# EasyEDA schematic Schematic_drone.json
TITLE: DRONE PCB; REV: 1.0; Date: 2023-12-03; Sheet: 1/1; Drawn By: s3713061; Company: Your Company
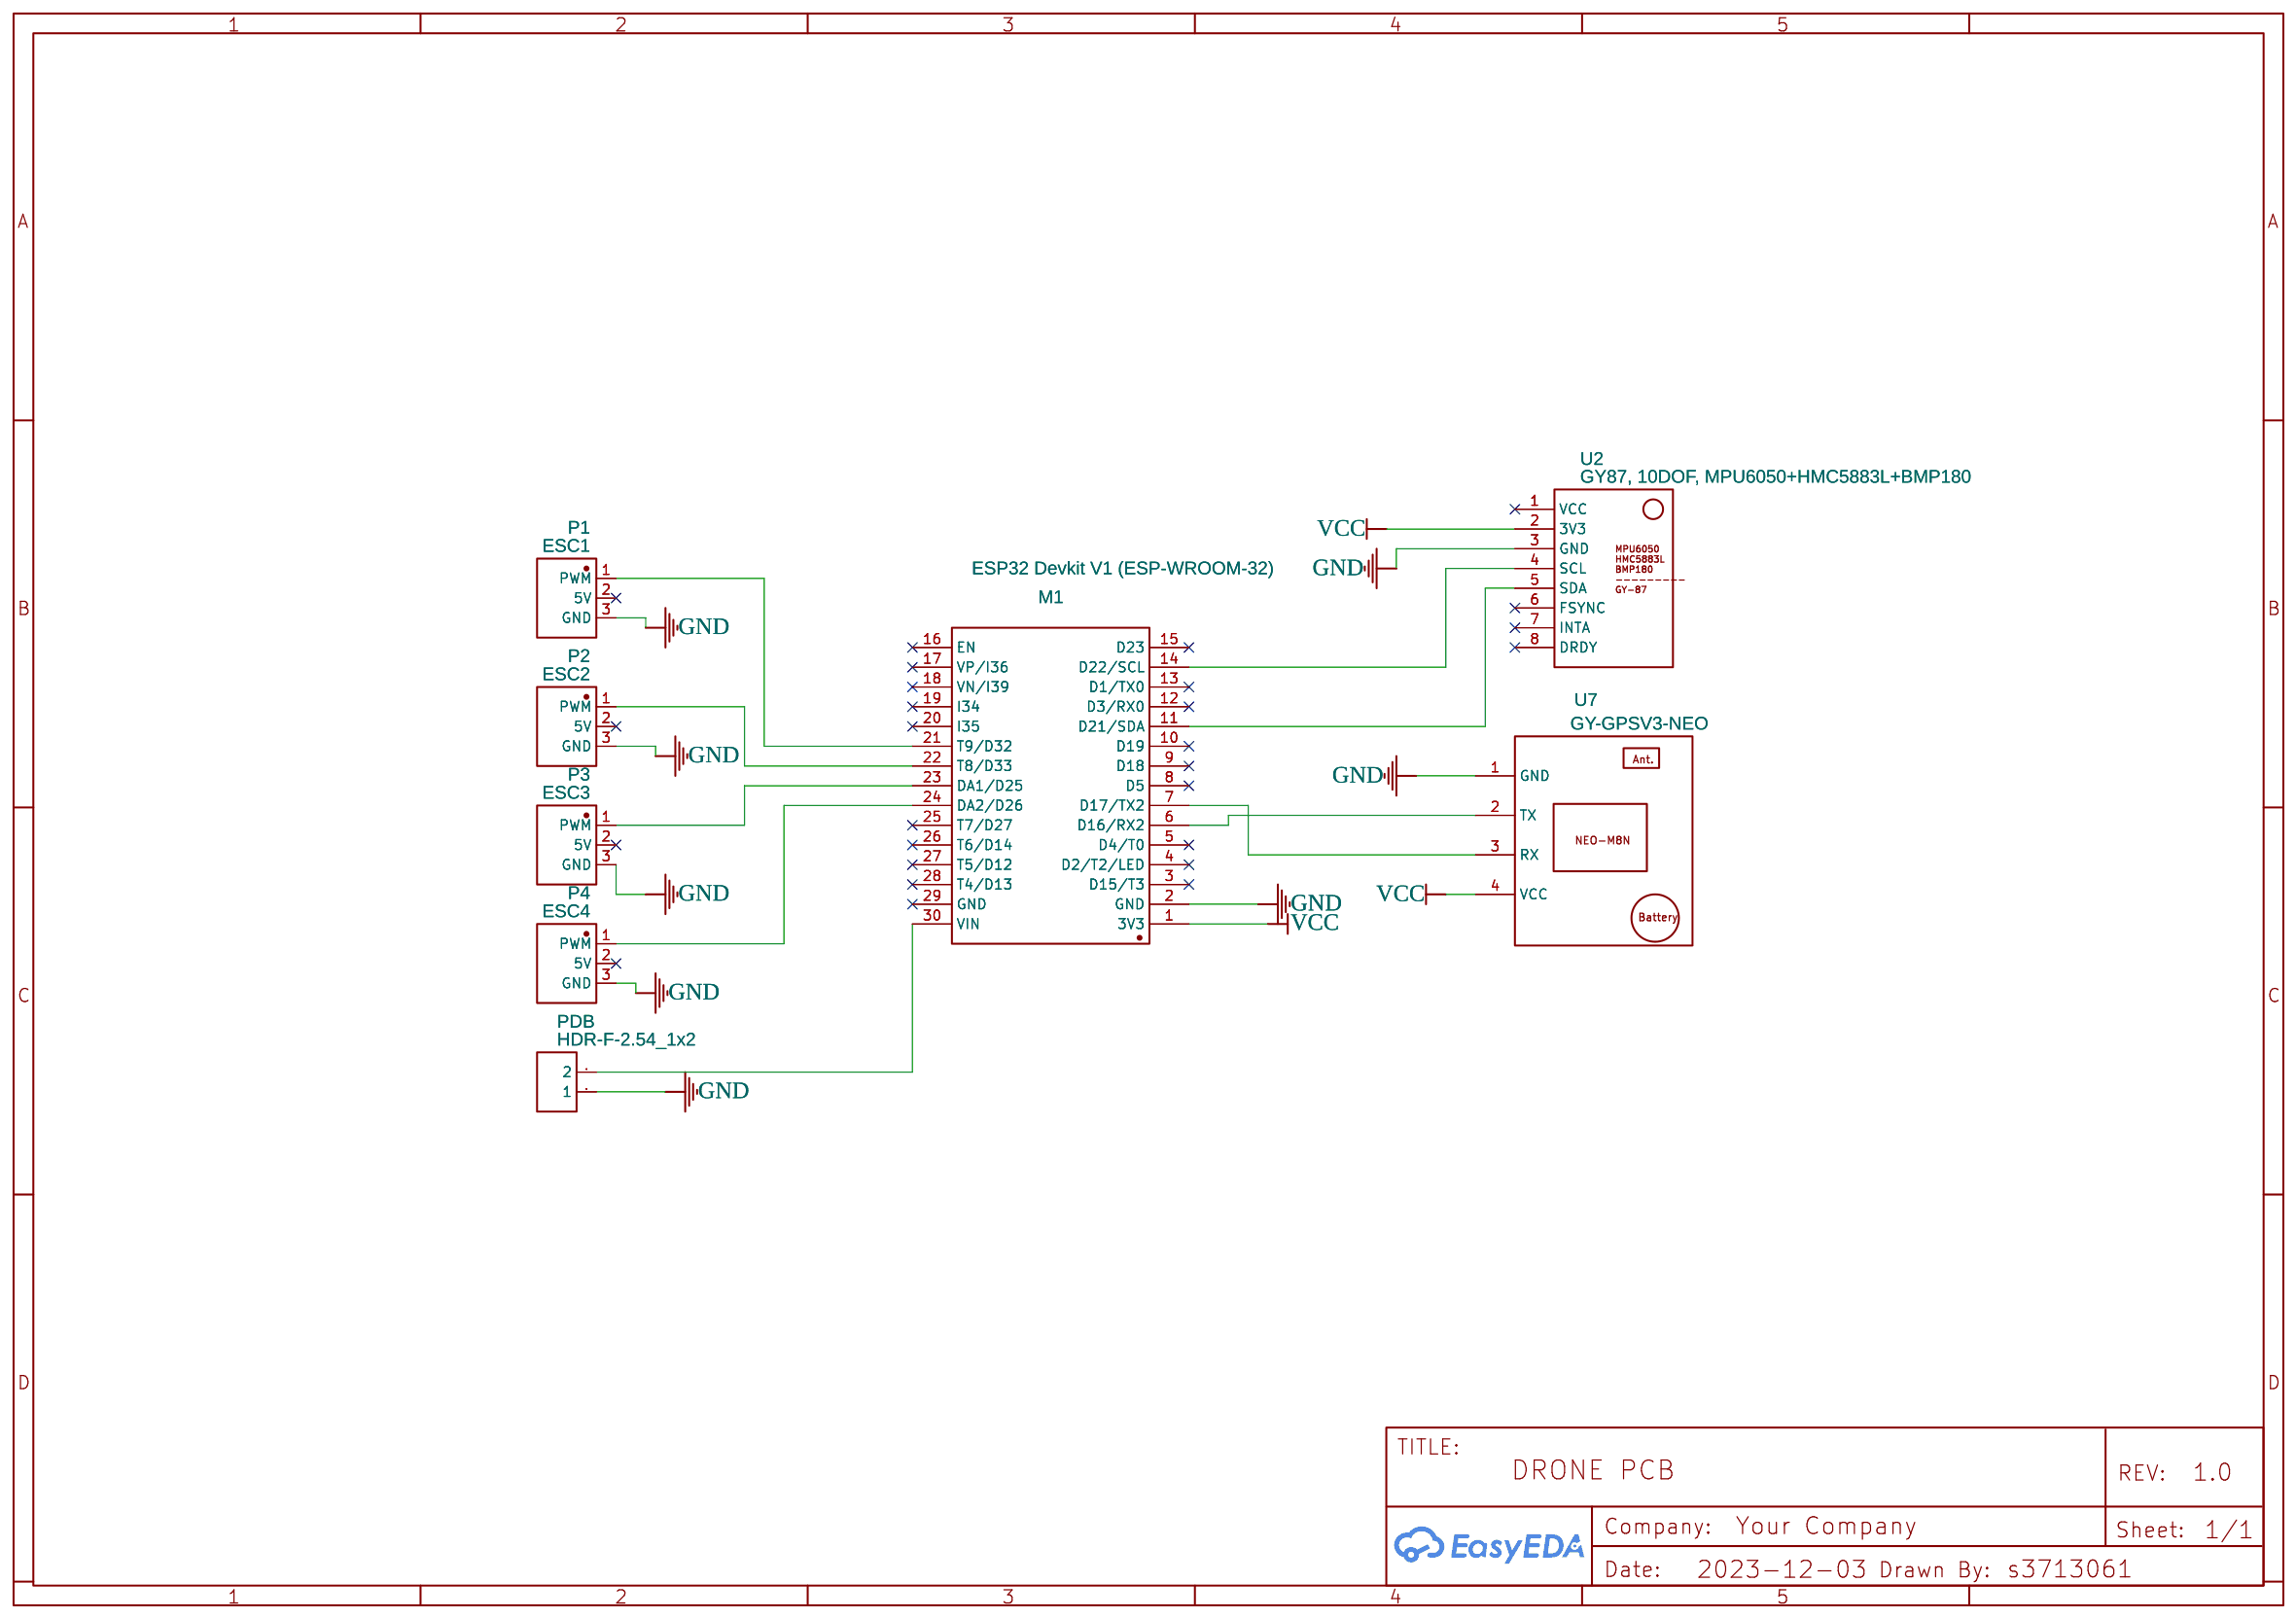
[diagram p0: schematic sheet]

## Parts
M1  ESP32 Devkit V1 (ESP-WROOM-32)  [S.MOD.ESP32 DOIT DEVKIT 1]
P1  ESC1  [HDR-3X1/2.54]
P2  ESC2  [HDR-3X1/2.54]
P3  ESC3  [HDR-3X1/2.54]
P4  ESC4  [HDR-3X1/2.54]
PDB  HDR-F-2.54_1x2  [HDR-F-2.54_1X2]
U2  GY87, 10DOF, MPU6050+HMC5883L+BMP180  [GY-86]
U7  GY-GPSV3-NEO  [GY-GPSV3-NEO]

## Library data of the parts
M1 = S.Mod.ESP32_DOIT_V1 copy: Contributor: thecvely
P1 = ESCPort: Manufacturer: Header2.54mm; Supplier: LCSC; Supplier Part: C49257; Contributor: huang.harry1314; Package Display: No; image: //image.lceda.cn/szlcsc/C49257.jpg
P2-P4 = ESCPort: Manufacturer: Header2.54mm; Supplier: LCSC; Supplier Part: C49257; Contributor: huang.harry1314; image: //image.lceda.cn/szlcsc/C49257.jpg
PDB = HDR-F-2.54_1x2: Supplier Part: C49661; Supplier: LCSC; Manufacturer: Header2.54mm; Contributor: LCEDA_Lib
U2 = GY87, 10DOF, MPU6050+HMC5883L+BMP180: Contributor: sakuyaki
U7 = GY-GPSV3-NEO COPY COPY: Contributor: rjshiffer

## Nets
GND: M1.2(GND) P1.3(GND) P2.3(GND) P3.3(GND) P4.3(GND) PDB.1 U2.3(GND) U7.1(GND)
VCC: M1.1(3V3) U2.2(3V3) U7.4(VCC)
Net-(M1-6): M1.6(D16/RX2) U7.2(TX)
Net-(M1-7): M1.7(D17/TX2) U7.3(RX)
Net-(M1-11): M1.11(D21/SDA) U2.5(SDA)
Net-(M1-14): M1.14(D22/SCL) U2.4(SCL)
Net-(M1-21): M1.21(T9/D32) P1.1(PWM)
Net-(M1-22): M1.22(T8/D33) P2.1(PWM)
Net-(M1-23): M1.23(DA1/D25) P3.1(PWM)
Net-(M1-24): M1.24(DA2/D26) P4.1(PWM)
Net-(M1-30): M1.30(VIN) PDB.2

Not connected (* = marked no-connect by the designer): M1 3(D15/T3)* 4(D2/T2/LED)* 5(D4/T0)* 8(D5)* 9(D18)* 10(D19)* 12(D3/RX0)* 13(D1/TX0)* 15(D23)* 16(EN)* 17(VP/I36)* 18(VN/I39)* 19(I34)* 20(I35)* 25(T7/D27)* 26(T6/D14)* 27(T5/D12)* 28(T4/D13)* 29(GND)*; P1 2(5V)*; P2 2(5V)*; P3 2(5V)*; P4 2(5V)*; U2 1(VCC)* 6(FSYNC)* 7(INTA)* 8(DRDY)*
